# Altium project PCB_Project.PrjPcb
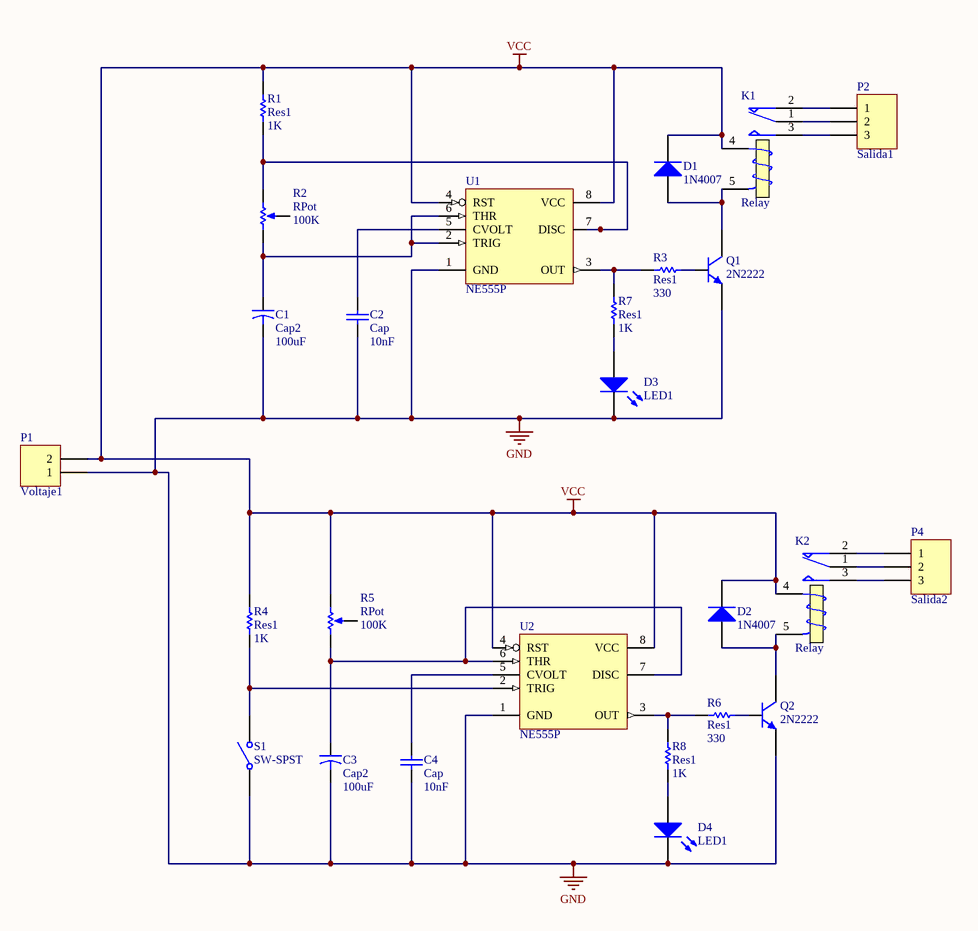
[diagram p0: SCH_555.SchDoc]
1 sheet, 26 parts. Net scope: global (net labels, ports and power ports of the same name join across sheets).
Board file: PCB_555ATM.PcbDoc

## Sheet SCH_555.SchDoc
size A4

### Parts
C1  Cap2  value 100uF  [Cap 100uf 25v]
C2  Cap  value 10nF  [CAP]
C3  Cap2  value 100uF  [Cap 100uf 25v]
C4  Cap  value 10nF  [CAP]
D1  1N4007  [DO-41]
D2  1N4007  [DO-41]
D3  LED1  [Cap 100uf 25v]
D4  LED1  [Cap 100uf 25v]
K1  Relay  [Relay]
K2  Relay  [Relay]
P1  Voltaje1  [TErminal]
P2  Salida1  [TErminal3]
P4  Salida2  [TErminal3]
Q1  2N2222  [TO-92A]
Q2  2N2222  [TO-92A]
R1  Res1  value 1K  [AXIAL-0.3]
R2  RPot  value 100K  [Potenciometro]
R3  Res1  value 330  [AXIAL-0.3]
R4  Res1  value 1K  [AXIAL-0.3]
R5  RPot  value 100K  [Potenciometro]
R6  Res1  value 330  [AXIAL-0.3]
R7  Res1  value 1K  [AXIAL-0.3]
R8  Res1  value 1K  [AXIAL-0.3]
S1  SW-SPST  [PUSHB]
U1  NE555P  [P008]
U2  NE555P  [P008]

### Nets
GND: C1.2 C2.1 C3.2 C4.1 D3.2(K) D4.2(K) P1.1 Q1.1(E) Q2.1(E) S1.1(COMMON) U1.1(GND) U2.1(GND)
VCC: D1.2(K) D2.2(K) K1.4(T1) K2.4(T1) P1.2 R1.2 R4.2 R5.2(BOT) U1.4(RST) U1.8(VCC) U2.4(RST) U2.8(VCC)
NetC1_1: C1.1 R2.1(TOP) U1.2(TRIG) U1.6(THR)
NetC2_2: C2.2 U1.5(CVOLT)
NetC3_1: C3.1 R5.1(TOP) U2.6(THR) U2.7(DISC)
NetC4_2: C4.2 U2.5(CVOLT)
NetD1_1: D1.1(A) K1.5(T2) Q1.3(C)
NetD2_1: D2.1(A) K2.5(T2) Q2.3(C)
NetD3_1: D3.1(A) R7.1
NetD4_1: D4.1(A) R8.1
NetK1_1: K1.1(COM) P2.2
NetK1_2: K1.2(NC) P2.1
NetK1_3: K1.3(NO) P2.3
NetK2_1: K2.1(COM) P4.2
NetK2_2: K2.2(NC) P4.1
NetK2_3: K2.3(NO) P4.3
NetQ1_2: Q1.2(B) R3.2
NetQ2_2: Q2.2(B) R6.2
NetR1_1: R1.1 R2.2(BOT) U1.7(DISC)
NetR3_1: R3.1 R7.2 U1.3(OUT)
NetR4_1: R4.1 S1.2(NO) U2.2(TRIG)
NetR6_1: R6.1 R8.2 U2.3(OUT)

Not connected (* = marked no-connect by the designer): R2 3(TAP); R5 3(TAP)

### Library data of the parts
C1 C3 = Cap2: Capacitor; Published: 23-Sep-2002; PackageReference: CAPR5-4X5; Publisher: Altium Limited; PackageDescription: Capacitor; 2 Leads
C2 C4 = Cap: Capacitor; Published: 8-Jun-2000; LatestRevisionDate: 17-Jul-2002; LatestRevisionNote: Re-released for DXP Platform.; PackageReference: RAD-0.3; Publisher: Altium Limited; PackageDescription: Radial Cap, Thru-Hole; 2 Leads; 0.3 in Pin Spacing
D1 D2 = Diode 1N4007: 1 Amp General Purpose Rectifier; Published: 8-Jun-2000; LatestRevisionDate: 17-Jul-2002; LatestRevisionNote: Re-released for DXP Platform.; DatasheetVersion: 1998; PackageVersion: Aug-1999; PackageReference: DO-41; Publisher: Altium Limited; PackageDescription: Diode, Axial; Body 5.2 x 2.7 mm (LxDia. max), Lead Dia. 0.86 mm (max); Code_JEDEC: DO-204-AL; ComponentLink1Description: Manufacturer Link; ComponentLink1URL: http://www.fairchildsemi.com/; ComponentLink2Description: Datasheet; ComponentLink2URL: http://www.fairchildsemi.com/ds/1N%2F1N4001.pdf
D3 D4 = LED1: Typical RED GaAs LED; Published: 8-Jun-2000; LatestRevisionDate: 08-Jul-2005; LatestRevisionNote: Mech Layer 1 removed.; PackageReference: LED-1; Publisher: Altium Limited; PackageDescription: LED; 2 Leads
K1 K2 = Relay: SPDT Relay; Published: 8-Jun-2000; LatestRevisionDate: 17-Jul-2002; LatestRevisionNote: Re-released for DXP Platform.; PackageReference: MODULE5B; Publisher: Altium Limited
P1 = Header 2: Header, 2-Pin; LatestRevisionDate: 17-Jul-2002; LatestRevisionNote: Re-released for DXP Platform.; Publisher: Altium Limited
P2 P4 = Header 3: Header, 3-Pin; LatestRevisionDate: 17-Jul-2002; LatestRevisionNote: Re-released for DXP Platform.; Publisher: Altium Limited
Q1 Q2 = 2N3904: NPN General Purpose Amplifier; Published: 8-Jun-2000; LatestRevisionDate: 15-Jan-2003; LatestRevisionNote: PCB Footprint 'BCY-W3/D4.7' replaced; DatasheetVersion: 1997; PackageVersion: Sep-1998; PackageReference: TO-92A; Publisher: Altium Limited; PackageDescription: TO, Flat Index; 3 In-Line, Axial Leads; Body Dia. 4.5mm; Leads 0.51 x 0.48 mm (max); ComponentLink1Description: Manufacturer Link; ComponentLink1URL: http://www.fairchildsemi.com/; ComponentLink2Description: Datasheet; ComponentLink2URL: http://www.fairchildsemi.com/ds/2N%2F2N3904.pdf
R1 R3 R4 R6-R8 = Res1: Resistor; Published: 8-Jun-2000; LatestRevisionDate: 17-Jul-2002; LatestRevisionNote: Re-released for DXP Platform.; PackageReference: AXIAL-0.3; Publisher: Altium Limited; PackageDescription: Axial Device, Thru-Hole; 2 Leads; 0.3 in Pin Spacing
R2 R5 = RPot: Potentiometer; Sim Note: Enter the Resistance value and the set point into parameter fields.; Set Position: 0.5; Published: 8-Jun-2000; LatestRevisionDate: 17-Jul-2002; LatestRevisionNote: Re-released for DXP Platform.; PackageReference: VR5; Publisher: Altium Limited; PackageDescription: Variable Resistor, Thru-Hole; 3 Leads
S1 = SW-SPST: Single-Pole, Single-Throw Switch; Published: 24-Mar-1999; LatestRevisionDate: 17-Jul-2002; LatestRevisionNote: Re-released for DXP Platform.; PackageReference: SPST-2; Publisher: Altium Limited; PackageDescription: Switch; 2 Leads
U1 U2 = NE555P: Precision Timer; Published: 16-Jan-2001; LatestRevisionDate: 04-Mar-2005; LatestRevisionNote: Stylized 3D Model Added.; DatasheetVersion: Feb-1992; PackageVersion: Jun-1999; PackageReference: P008; Publisher: Altium Limited; PackageDescription: DIP; 8 Leads; Row Spacing 7.62 mm; Pitch 2.54 mm; Code_JEDEC: MO-001-AN; ComponentLink1Description: Manufacturer Link; ComponentLink1URL: http://www.ti.com/; ComponentLink2Description: Datasheet; ComponentLink2URL: http://www-s.ti.com/sc/ds/ne555.pdf